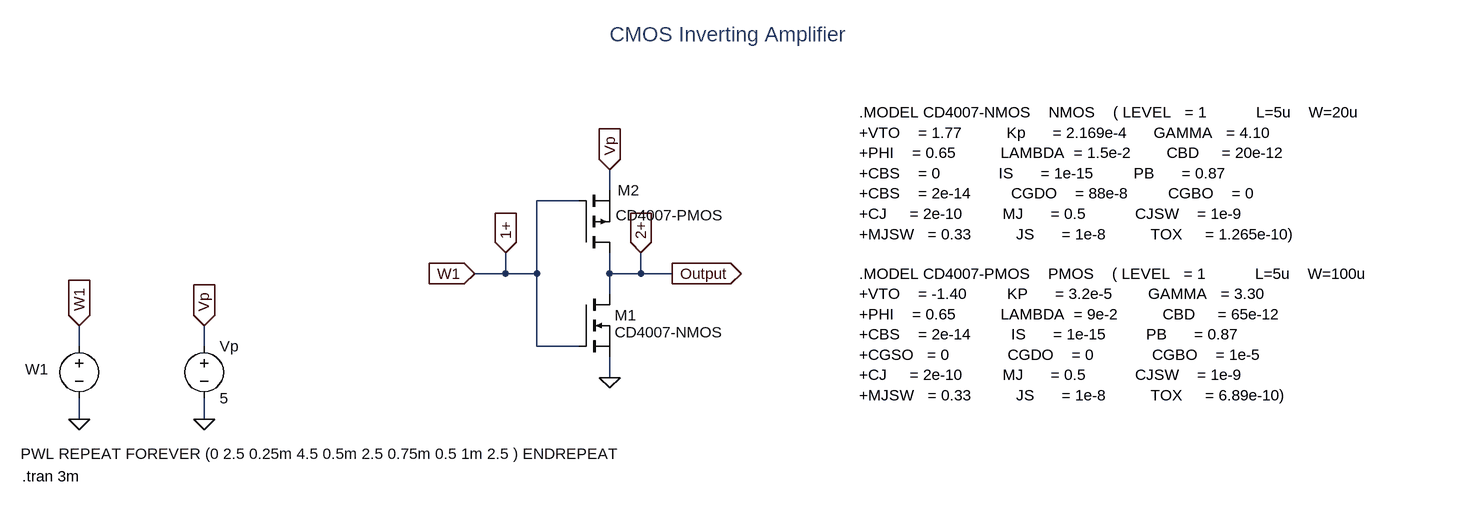
[diagram p0: schematic cmos_inv_amplifier.asc]
cmos_inv_amplifier.asc, the LTspice schematic file:
Version 4
SHEET 1 6340 1168
WIRE -64 320 -64 288
WIRE -112 336 -176 336
WIRE -224 448 -224 416
WIRE -224 448 -272 448
WIRE -176 448 -176 336
WIRE -176 448 -224 448
WIRE -64 448 -64 416
WIRE -16 448 -16 416
WIRE -16 448 -64 448
WIRE 32 448 -16 448
WIRE -64 480 -64 448
WIRE -880 560 -880 528
WIRE -688 560 -688 528
WIRE -176 560 -176 448
WIRE -112 560 -176 560
WIRE -64 608 -64 576
WIRE -880 672 -880 640
WIRE -688 672 -688 640
FLAG -64 608 0
FLAG -64 288 Vp
IOPIN -64 288 In
FLAG -272 448 W1
IOPIN -272 448 In
FLAG 32 448 Output
IOPIN 32 448 Out
FLAG -880 672 0
FLAG -688 672 0
FLAG -688 528 Vp
IOPIN -688 528 In
FLAG -880 528 W1
IOPIN -880 528 In
FLAG -224 416 1+
IOPIN -224 416 In
FLAG -16 416 2+
IOPIN -16 416 In
SYMBOL nmos -112 480 R0
WINDOW 3 56 58 Left 2
SYMATTR Value CD4007-NMOS
SYMATTR InstName M1
SYMBOL pmos -112 416 M180
WINDOW 3 57 58 Left 2
WINDOW 0 60 96 Left 2
SYMATTR Value CD4007-PMOS
SYMATTR InstName M2
SYMBOL voltage -688 544 R0
WINDOW 123 0 0 Left 0
WINDOW 39 0 0 Left 0
SYMATTR InstName Vp
SYMATTR Value 5
SYMBOL voltage -880 544 R0
WINDOW 0 -83 51 Left 2
WINDOW 3 -90 181 Left 2
WINDOW 123 0 0 Left 0
WINDOW 39 0 0 Left 0
SYMATTR InstName W1
SYMATTR Value PWL REPEAT FOREVER (0 2.5 0.25m 4.5 0.5m 2.5 0.75m 0.5 1m 2.5 ) ENDREPEAT
TEXT 320 200 Left 2 !.MODEL CD4007-NMOS    NMOS    ( LEVEL   = 1           L=5u    W=20u             \n+VTO    = 1.77          Kp      = 2.169e-4      GAMMA   = 4.10  \n+PHI    = 0.65          LAMBDA  = 1.5e-2        CBD     = 20e-12\n+CBS    = 0             IS      = 1e-15         PB      = 0.87\n+CBS    = 2e-14         CGDO    = 88e-8         CGBO    = 0\n+CJ     = 2e-10         MJ      = 0.5           CJSW    = 1e-9\n+MJSW   = 0.33          JS      = 1e-8          TOX     = 1.265e-10)
TEXT 320 448 Left 2 !.MODEL CD4007-PMOS    PMOS    ( LEVEL   = 1           L=5u    W=100u                \n+VTO    = -1.40         KP      = 3.2e-5        GAMMA   = 3.30  \n+PHI    = 0.65          LAMBDA  = 9e-2          CBD     = 65e-12\n+CBS    = 2e-14         IS      = 1e-15         PB      = 0.87\n+CGSO   = 0             CGDO    = 0             CGBO    = 1e-5\n+CJ     = 2e-10         MJ      = 0.5           CJSW    = 1e-9\n+MJSW   = 0.33          JS      = 1e-8          TOX     = 6.89e-10)
TEXT -64 80 Left 3 ;CMOS Inverting Amplifier
TEXT -968 760 Left 2 !.tran 3m

The netlist it stands for:
* cmos_inv_amplifier.asc
M1 2+ 1+ 0 0 CD4007-NMOS
M2 2+ 1+ Vp Vp CD4007-PMOS
Vp Vp 0 5
V§W1 1+ 0 PWL REPEAT FOREVER (0 2.5 0.25m 4.5 0.5m 2.5 0.75m 0.5 1m 2.5 ) ENDREPEAT
.model NMOS NMOS
.model PMOS PMOS
.lib standard.mos
.MODEL CD4007-NMOS    NMOS    ( LEVEL   = 1           L=5u    W=20u
+VTO    = 1.77          Kp      = 2.169e-4      GAMMA   = 4.10
+PHI    = 0.65          LAMBDA  = 1.5e-2        CBD     = 20e-12
+CBS    = 0             IS      = 1e-15         PB      = 0.87
+CBS    = 2e-14         CGDO    = 88e-8         CGBO    = 0
+CJ     = 2e-10         MJ      = 0.5           CJSW    = 1e-9
+MJSW   = 0.33          JS      = 1e-8          TOX     = 1.265e-10)
.MODEL CD4007-PMOS    PMOS    ( LEVEL   = 1           L=5u    W=100u
+VTO    = -1.40         KP      = 3.2e-5        GAMMA   = 3.30
+PHI    = 0.65          LAMBDA  = 9e-2          CBD     = 65e-12
+CBS    = 2e-14         IS      = 1e-15         PB      = 0.87
+CGSO   = 0             CGDO    = 0             CGBO    = 1e-5
+CJ     = 2e-10         MJ      = 0.5           CJSW    = 1e-9
+MJSW   = 0.33          JS      = 1e-8          TOX     = 6.89e-10)
* CMOS Inverting Amplifier
.tran 3m
.backanno
.end